# Altium schematic sheet QSPI.SchDoc
size A4; DocumentNumber: 5; SheetNumber: 5; SheetTotal: 15
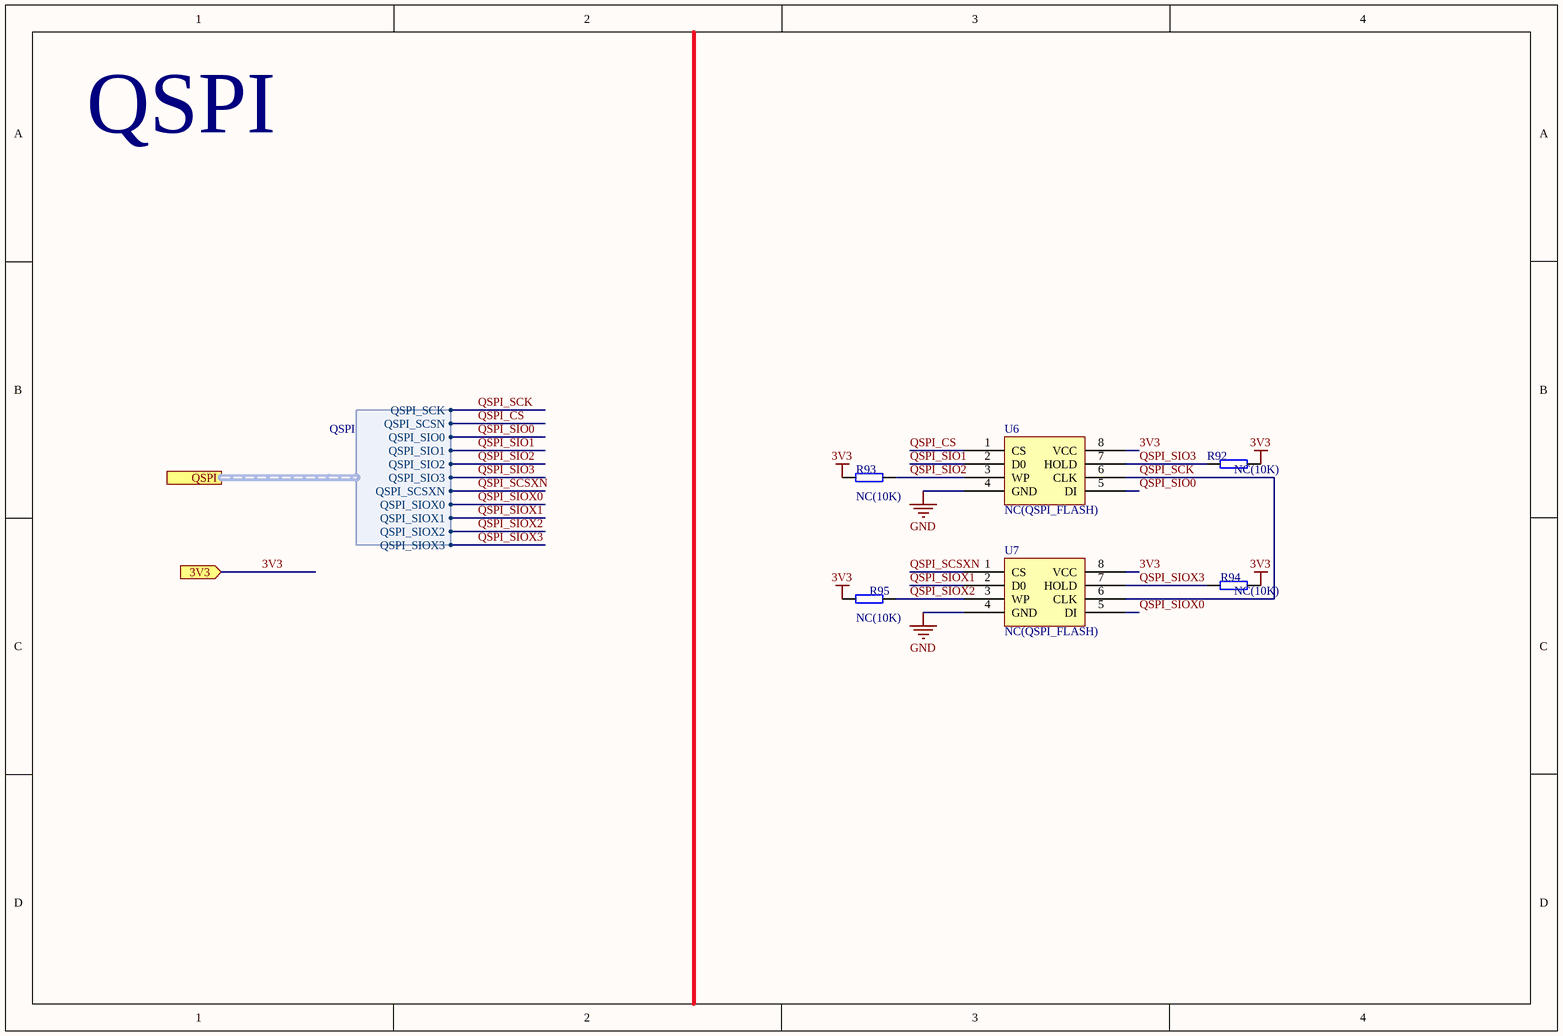
[diagram p0: QSPI.SchDoc]

## Parts
R92  NC(10K)  [0402]
R93  NC(10K)  [0402]
R94  NC(10K)  [0402]
R95  NC(10K)  [0402]
U6  NC(QSPI_FLASH)  [SOIC-8_208mil]
U7  NC(QSPI_FLASH)  [SOIC-8_208mil]

## Ports
3V3 (in), QSPI (harness QSPI)

## Harnesses
QSPI: QSPI_SCK, QSPI_SCSN, QSPI_SIO0, QSPI_SIO1, QSPI_SIO2, QSPI_SIO3, QSPI_SCSXN, QSPI_SIOX0, QSPI_SIOX1, QSPI_SIOX2, QSPI_SIOX3

## Nets
3V3: R92.1 R93.2 R94.1 R95.2 U6.8(VCC) U7.8(VCC) ; port 3V3
GND: U6.4(GND) U7.4(GND)
QSPI_CS: U6.1(CS) ; port QSPI.QSPI_SCSN
QSPI_SCK: U6.6(CLK) U7.6(CLK) ; port QSPI.QSPI_SCK
QSPI_SCSXN: U7.1(CS) ; port QSPI.QSPI_SCSXN
QSPI_SIO0: U6.5(DI) ; port QSPI.QSPI_SIO0
QSPI_SIO1: U6.2(D0) ; port QSPI.QSPI_SIO1
QSPI_SIO2: R93.1 U6.3(WP) ; port QSPI.QSPI_SIO2
QSPI_SIO3: R92.2 U6.7(HOLD) ; port QSPI.QSPI_SIO3
QSPI_SIOX0: U7.5(DI) ; port QSPI.QSPI_SIOX0
QSPI_SIOX1: U7.2(D0) ; port QSPI.QSPI_SIOX1
QSPI_SIOX2: R95.1 U7.3(WP) ; port QSPI.QSPI_SIOX2
QSPI_SIOX3: R94.2 U7.7(HOLD) ; port QSPI.QSPI_SIOX3

## Notes on the sheet
- QSPI

## Library data of the parts
R92-R95 = RES
U6 U7 = W25Q64